# EAGLE schematic nekojara_board (EAGLE 8.4.2)
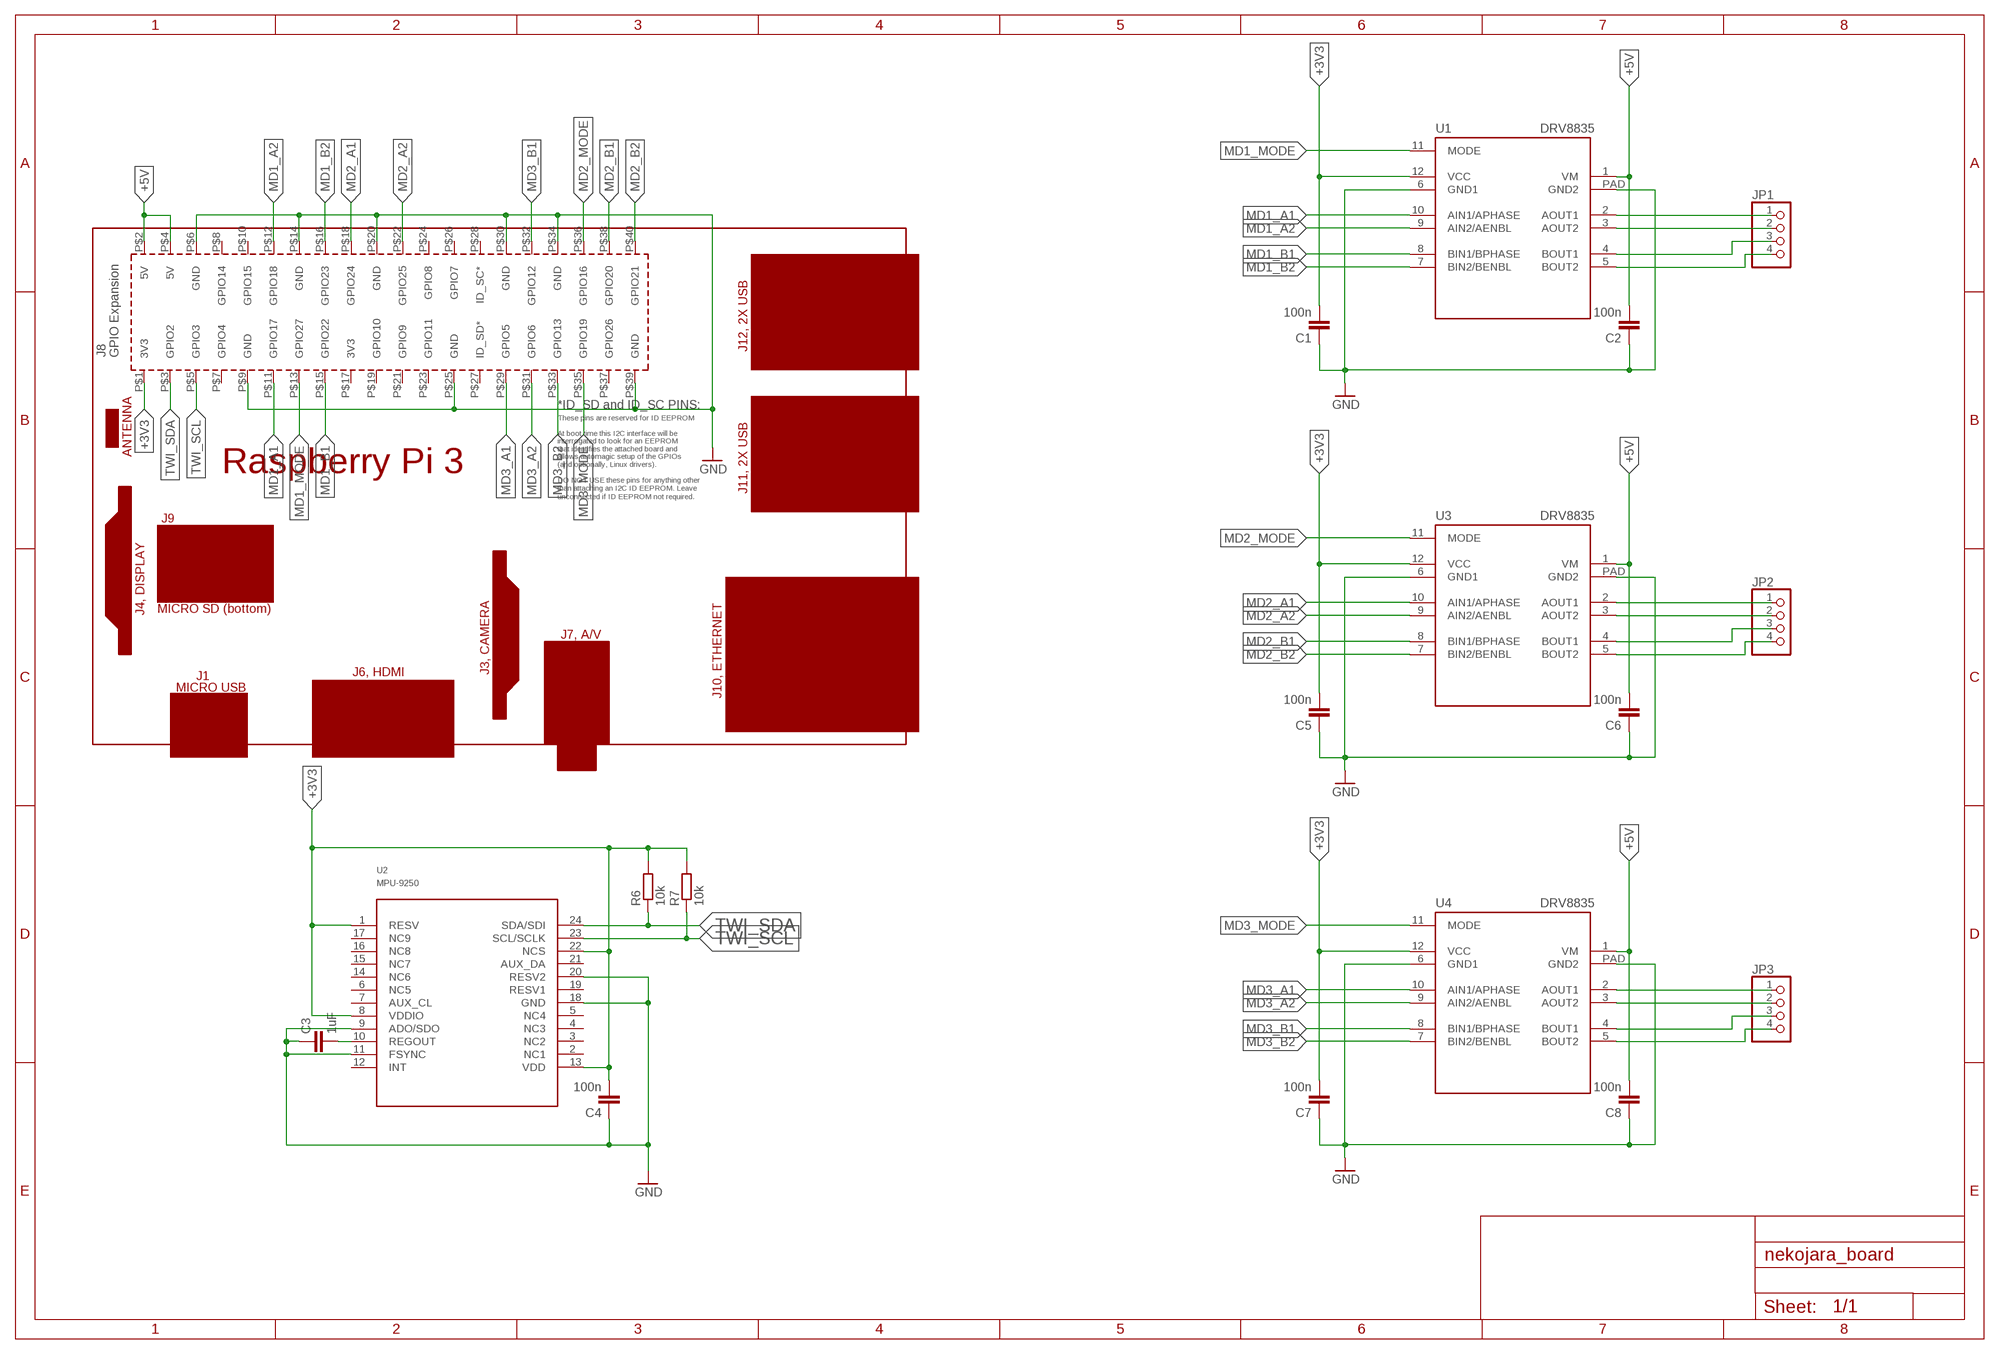
[diagram p0: schematic, sheet 1]

## Parts
C1  100n  C-EUC0402  [C0402]
C2  100n  C-EUC0402  [C0402]
C3  1uF  C-EUC0402  [C0402]
C4  100n  C-EUC0402  [C0402]
C5  100n  C-EUC0402  [C0402]
C6  100n  C-EUC0402  [C0402]
C7  100n  C-EUC0402  [C0402]
C8  100n  C-EUC0402  [C0402]
JP1  PINHD-1X4  [1X04]
JP2  PINHD-1X4  [1X04]
JP3  PINHD-1X4  [1X04]
PCB1  RPI3  [RPI3]
R6  10k  R-EU_R0402  [R0402]
R7  10k  R-EU_R0402  [R0402]
U1  DRV8835  [WSON_2X3]
U2  MPU-9250  [LEAD-QFN24]
U3  DRV8835  [WSON_2X3]
U4  DRV8835  [WSON_2X3]

## Nets
+3V3: C1.2 C4.2 C5.2 C7.2 PCB1.P$1(3V3) R6.2 R7.2 U1.12(VCC) U2.1(RESV) U2.8(VDDIO) U2.13(VDD) U2.22(NCS) U3.12(VCC) U4.12(VCC)
+5V: C2.2 C6.2 C8.2 PCB1.P$2(5V) PCB1.P$4(5V) U1.1(VM) U3.1(VM) U4.1(VM)
GND [GND]: C1.1 C2.1 C3.1 C4.1 C5.1 C6.1 C7.1 C8.1 PCB1.P$6(GND) PCB1.P$9(GND) PCB1.P$14(GND) PCB1.P$20(GND) PCB1.P$25(GND) PCB1.P$30(GND) PCB1.P$34(GND) PCB1.P$39(GND) U1.6(GND1) U1.PAD(GND2) U2.9(ADO/SDO) U2.11(FSYNC) U2.18(GND) U2.20(RESV2) U3.6(GND1) U3.PAD(GND2) U4.6(GND1) U4.PAD(GND2)
MD1_A1: PCB1.P$11(GPIO17) U1.10(AIN1/APHASE)
MD1_A2: PCB1.P$12(GPIO18) U1.9(AIN2/AENBL)
MD1_B1: PCB1.P$15(GPIO22) U1.8(BIN1/BPHASE)
MD1_B2: PCB1.P$16(GPIO23) U1.7(BIN2/BENBL)
MD1_MODE: PCB1.P$13(GPIO27) U1.11(MODE)
MD2_A1: PCB1.P$18(GPIO24) U3.10(AIN1/APHASE)
MD2_A2: PCB1.P$22(GPIO25) U3.9(AIN2/AENBL)
MD2_B1: PCB1.P$38(GPIO20) U3.8(BIN1/BPHASE)
MD2_B2: PCB1.P$40(GPIO21) U3.7(BIN2/BENBL)
MD2_MODE: PCB1.P$36(GPIO16) U3.11(MODE)
MD3_A1: PCB1.P$29(GPIO5) U4.10(AIN1/APHASE)
MD3_A2: PCB1.P$31(GPIO6) U4.9(AIN2/AENBL)
MD3_B1: PCB1.P$32(GPIO12) U4.8(BIN1/BPHASE)
MD3_B2: PCB1.P$33(GPIO13) U4.7(BIN2/BENBL)
MD3_MODE: PCB1.P$35(GPIO19) U4.11(MODE)
N$1: JP1.1 U1.2(AOUT1)
N$2: JP1.2 U1.3(AOUT2)
N$3: JP1.3 U1.4(BOUT1)
N$5: JP1.4 U1.5(BOUT2)
N$6: JP2.1 U3.2(AOUT1)
N$7: JP2.2 U3.3(AOUT2)
N$8: JP2.3 U3.4(BOUT1)
N$9: JP2.4 U3.5(BOUT2)
N$10: JP3.1 U4.2(AOUT1)
N$11: JP3.2 U4.3(AOUT2)
N$12: JP3.3 U4.4(BOUT1)
N$13: JP3.4 U4.5(BOUT2)
REGOUT: C3.2 U2.10(REGOUT)
TWI_SCL: PCB1.P$5(GPIO3) R7.1 U2.23(SCL/SCLK)
TWI_SDA: PCB1.P$3(GPIO2) R6.1 U2.24(SDA/SDI)
Unconnected: PCB1.P$7(GPIO4) PCB1.P$8(GPIO14) PCB1.P$10(GPIO15) PCB1.P$17(3V3) PCB1.P$19(GPIO10) PCB1.P$21(GPIO9) PCB1.P$23(GPIO11) PCB1.P$24(GPIO8) PCB1.P$26(GPIO7) PCB1.P$27(ID_SD*) PCB1.P$28(ID_SC*) PCB1.P$37(GPIO26) U2.2(NC1) U2.3(NC2) U2.4(NC3) U2.5(NC4) U2.6(NC5) U2.7(AUX_CL) U2.12(INT) U2.14(NC6) U2.15(NC7) U2.16(NC8) U2.17(NC9) U2.19(RESV1) U2.21(AUX_DA)

## Library data of the parts
C1-C8 = resistor:C-EU: CAPACITOR, European symbol
JP1-JP3 = pinhead:PINHD-1X4: PIN HEADER
PCB1 = e14_Rpi3_RevA:RPI3: Device for Raspberry Pi 3 board created by Dave Young for www.element14.com More information and support community is available at https://www.element14.com/community/community/raspberry-pi
R6 R7 = resistor:R-EU_: RESISTOR, European symbol
U1 U3 U4 = bt_motordriver:DRV8835: DRV8835 DUAL LOW VOLTAGE H-BRIDGE IC The DRV8835 provides an integrated motor driver solution for cameras, consumer products, toys, and other low voltage or battery-powered motion control applications. The device has two H-bridge drivers, and can drive two DC motors or one stepper motor, as well as other devices like solenoids. The device has two H-bridge drivers, and drives two DC motors or one stepper motor, as well as other devices like solenoids. The output driver block for each consists of N-channel power MOSFETs configured as an H-bridge to drive the motor winding. An internal charge pump generates gate drive voltages. 1.5-A Maximum Drive Current Per H-Bridge Configure Bridges Parallel for 3-A Drive Curren 0-V to 11-V Motor-Operating Supply-Voltage 2-V to 7-V Logic Supply-Voltage Flexible PWM or PHASE/ENABLE Interface Low-Power Sleep Mode With 95-nA Maximum Supply Current Tiny 2.00-mm × 3.00-mm WSON Package Reference: http://www.ti.com/lit/ds/symlink/drv8835.pdf
U2 = invensense:MPU-9250

## Net classes
1 GND: width 0.508 mm, drill 0.3 mm, clearance 0.2 mm to class 0, clearance 0.2 mm